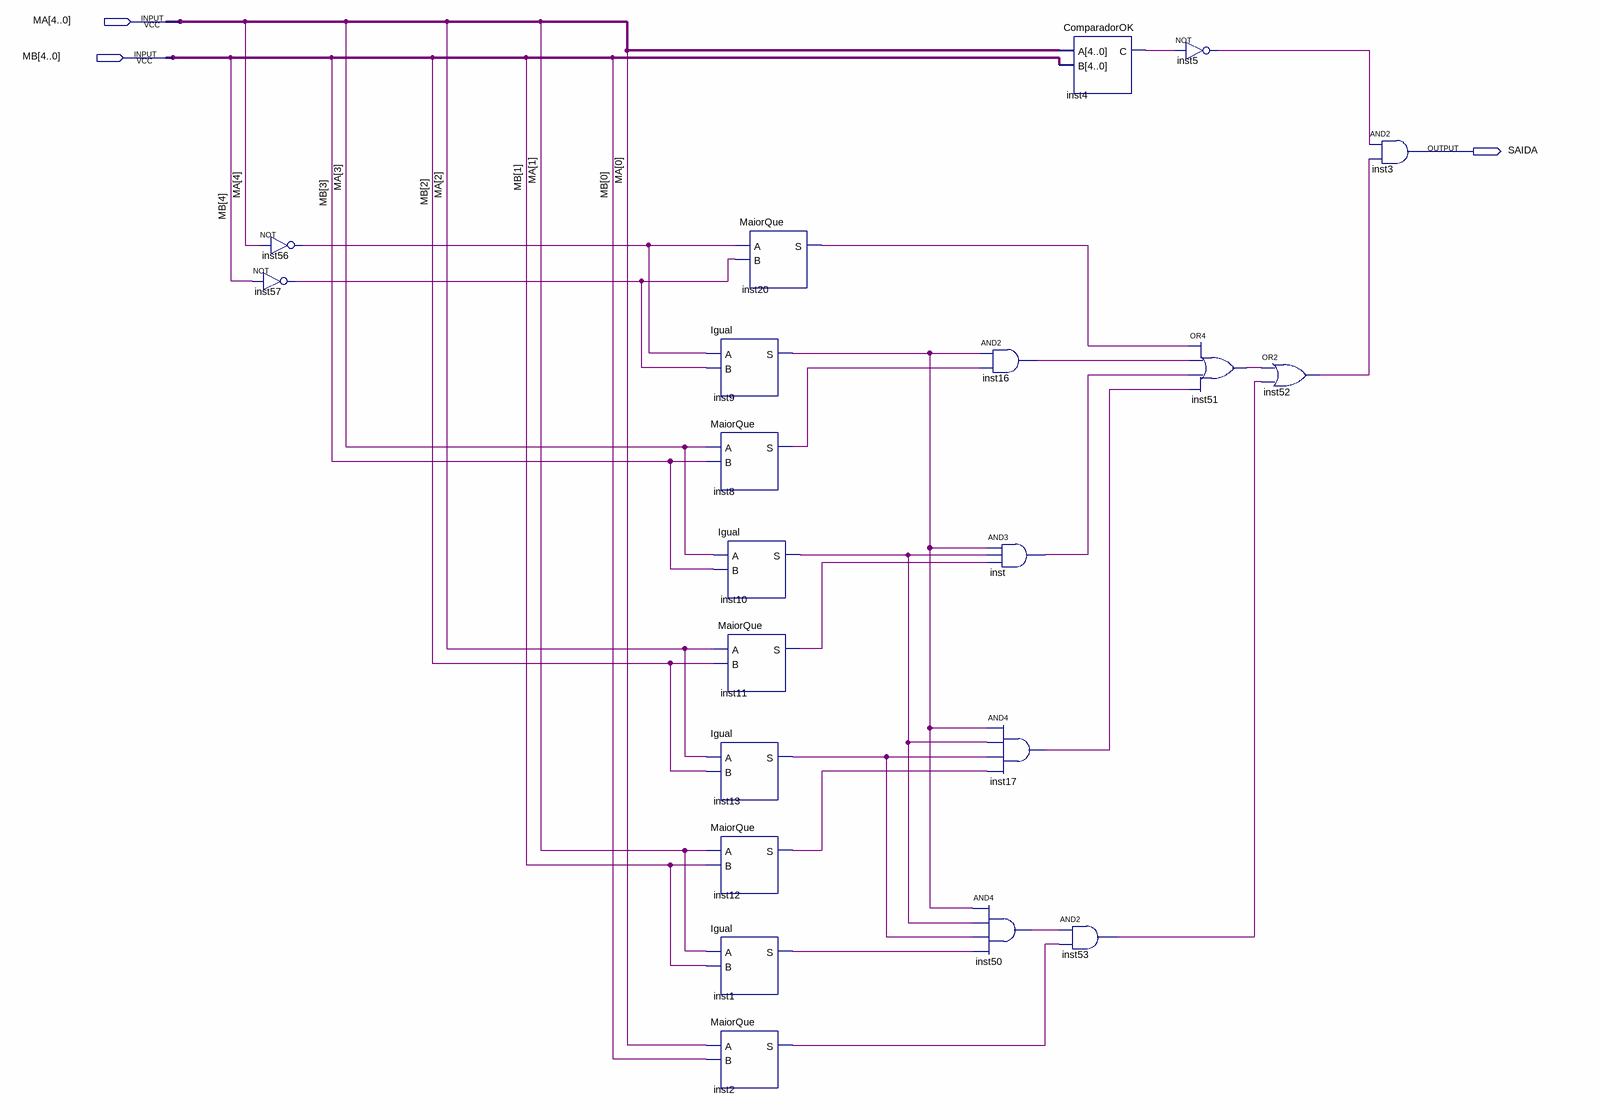
[diagram p0: schematic sheet]
// Quartus schematic MaiorQueOK.bdf as structural Verilog: 21 symbols, 3 pins
module MaiorQueOK (
  input  [4:0] MA,
  input  [4:0] MB,
  output SAIDA
);

  wire inst1_s, inst2_s, inst4_c, inst5_out, inst8_s, inst9_s, inst10_s, inst11_s, inst12_s, inst13_s,
       inst16_out, inst17_out, inst20_s, inst50_out, inst51_out, inst52_out, inst53_out, inst56_out,
       inst57_out, inst_out;

  not inst56 (inst56_out, MA[4]);
  not inst57 (inst57_out, MB[4]);
  Igual inst9 (.A(inst56_out), .B(inst57_out), .S(inst9_s));
  MaiorQue inst8 (.A(MA[3]), .B(MB[3]), .S(inst8_s));
  Igual inst10 (.A(MA[3]), .B(MB[3]), .S(inst10_s));
  MaiorQue inst11 (.A(MA[2]), .B(MB[2]), .S(inst11_s));
  Igual inst13 (.A(MA[2]), .B(MB[2]), .S(inst13_s));
  MaiorQue inst12 (.A(MA[1]), .B(MB[1]), .S(inst12_s));
  Igual inst1 (.A(MA[1]), .B(MB[1]), .S(inst1_s));
  MaiorQue inst2 (.A(MA[0]), .B(MB[0]), .S(inst2_s));
  MaiorQue inst20 (.A(inst56_out), .B(inst57_out), .S(inst20_s));
  and inst16 (inst16_out, inst9_s, inst8_s);
  and inst (inst_out, inst9_s, inst10_s, inst11_s);
  and inst17 (inst17_out, inst9_s, inst10_s, inst13_s, inst12_s);
  and inst50 (inst50_out, inst9_s, inst10_s, inst13_s, inst1_s);
  ComparadorOK inst4 (.A(MA), .B(MB), .C(inst4_c));
  and inst53 (inst53_out, inst50_out, inst2_s);
  not inst5 (inst5_out, inst4_c);
  or inst51 (inst51_out, inst20_s, inst16_out, inst_out, inst17_out);
  or inst52 (inst52_out, inst51_out, inst53_out);
  and inst3 (SAIDA, inst5_out, inst52_out);
endmodule
